# EAGLE design portal parkir atas (EAGLE 9.6.2)
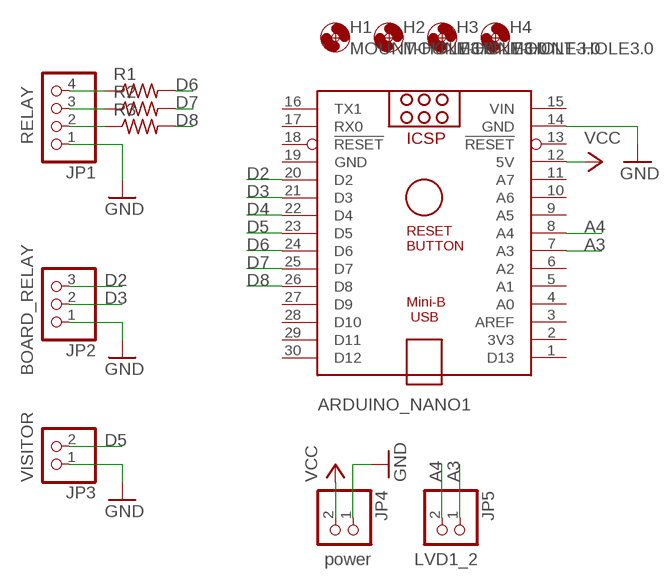
[diagram p0: schematic, sheet 1]

## Parts
ARDUINO_NANO1  ARDUINO_NANO  [ARDUINO_NANO]
H1  MOUNT-HOLE3.0  [3,0]
H2  MOUNT-HOLE3.0  [3,0]
H3  MOUNT-HOLE3.0  [3,0]
H4  MOUNT-HOLE3.0  [3,0]
JP1  PINHD-1X4  [1X04]
JP2  PINHD-1X3  [1X03]
JP3  PINHD-1X2  [1X02]
JP4  PINHD-1X2  [1X02]
JP5  PINHD-1X2  [1X02]
R1  R-US_0309/12  [0309/12]
R2  R-US_0309/12  [0309/12]
R3  R-US_0309/12  [0309/12]

## Nets
A3: ARDUINO_NANO1.7(A3) JP5.1
A4: ARDUINO_NANO1.8(A4) JP5.2
D2: ARDUINO_NANO1.20(D2) JP2.3
D3: ARDUINO_NANO1.21(D3) JP2.2
D4: ARDUINO_NANO1.22(D4)
D5: ARDUINO_NANO1.23(D5) JP3.2
D6: ARDUINO_NANO1.24(D6) R1.2
D7: ARDUINO_NANO1.25(D7) R2.2
D8: ARDUINO_NANO1.26(D8) R3.2
GND: ARDUINO_NANO1.14(GND) JP1.1 JP2.1 JP3.1 JP4.1
N$1: JP1.2 R3.1
N$2: JP1.3 R2.1
N$3: JP1.4 R1.1
VCC: ARDUINO_NANO1.12(5V) JP4.2
Unconnected: ARDUINO_NANO1.1(D13) ARDUINO_NANO1.2(3V3) ARDUINO_NANO1.3(AREF) ARDUINO_NANO1.4(A0) ARDUINO_NANO1.5(A1) ARDUINO_NANO1.6(A2) ARDUINO_NANO1.9(A5) ARDUINO_NANO1.10(A6) ARDUINO_NANO1.11(A7) ARDUINO_NANO1.13(!RESET) ARDUINO_NANO1.16(TX1) ARDUINO_NANO1.17(RX0) ARDUINO_NANO1.18(!RESET) ARDUINO_NANO1.27(D9) ARDUINO_NANO1.28(D10) ARDUINO_NANO1.29(D11) ARDUINO_NANO1.30(D12)

## Notes on the sheet
- RELAY
- BOARD_RELAY
- VISITOR
- power | LVD1_2

## Power pins joined to a net without a drawn wire
GND: ARDUINO_NANO1.19(GND)
VIN: ARDUINO_NANO1.15(VIN)

## Library data of the parts
ARDUINO_NANO1 = ArduinoNanoV30:ARDUINO_NANO: Arduino Nano V3.0 Overview: The Arduino Nano is a small, complete, and breadboard-friendly board based on the ATmega328 (Arduino Nano 3.x) or ATmega168 (Arduino Nano 2.x). It has more or less the same functionality of the Arduino Duemilanove, but in a different package. It lacks only a DC power jack, and works with a Mini-B USB cable instead of a standard one. The Nano was designed and is being produced by Gravitech. Specifications: Microcontroller Atmel ATmega168 or ATmega328 Operating Voltage (logic level) 5 V Input Voltage (recommended) 7-12 V Input Voltage (limits) 6-20 V Digital I/O Pins 14 (of which 6 provide PWM output) Analog Input Pins 8 DC Current per I/O Pin 40 mA Flash Memory 16 KB (ATmega168) or 32 KB (ATmega328) of which 2 KB used by bootloader SRAM 1 KB (ATmega168) or 2 KB (ATmega328) EEPROM 512 bytes (ATmega168) or 1 KB (ATmega328) Clock Speed 16 MHz Dimensions 0.73" x 1.70" Length 45 mm Width 18 mm Weigth 5 g Power: The Arduino Nano can be powered via the Mini-B USB connection, 6-20V unregulated external power supply (pin 30), or 5V regulated external power supply (pin 27). The power source is automatically selected to the highest voltage source. Memory: The ATmega168 has 16 KB of flash memory for storing code (of which 2 KB is used for the bootloader); the ATmega328 has 32 KB, (also with 2 KB used for the bootloader). The ATmega168 has 1 KB of SRAM and 512 bytes of EEPROM (which can be read and written with the EEPROM library); the ATmega328 has 2 KB of SRAM and 1 KB of EEPROM. Input and Output: Each of the 14 digital pins on the Nano can be used as an input or output, using pinMode(), digitalWrite(), and digitalRead() functions. They operate at 5 volts. Each pin can provide or receive a maximum of 40 mA and has an internal pull-up resistor (disconnected by default) of 20-50 kOhms. In addition, some pins have specialized functions. Visit Arduino - ArduinoBoardNano <https://www.arduino.cc/en/Main/ArduinoBoardNano>
H1-H4 = holes:MOUNT-HOLE: MOUNTING HOLE with drill center marker
JP1 = pinhead:PINHD-1X4: PIN HEADER
JP2 = pinhead:PINHD-1X3: PIN HEADER
JP3-JP5 = pinhead:PINHD-1X2: PIN HEADER
R1-R3 = rcl:R-US_: RESISTOR, American symbol; SPICEPREFIX: R

## Board
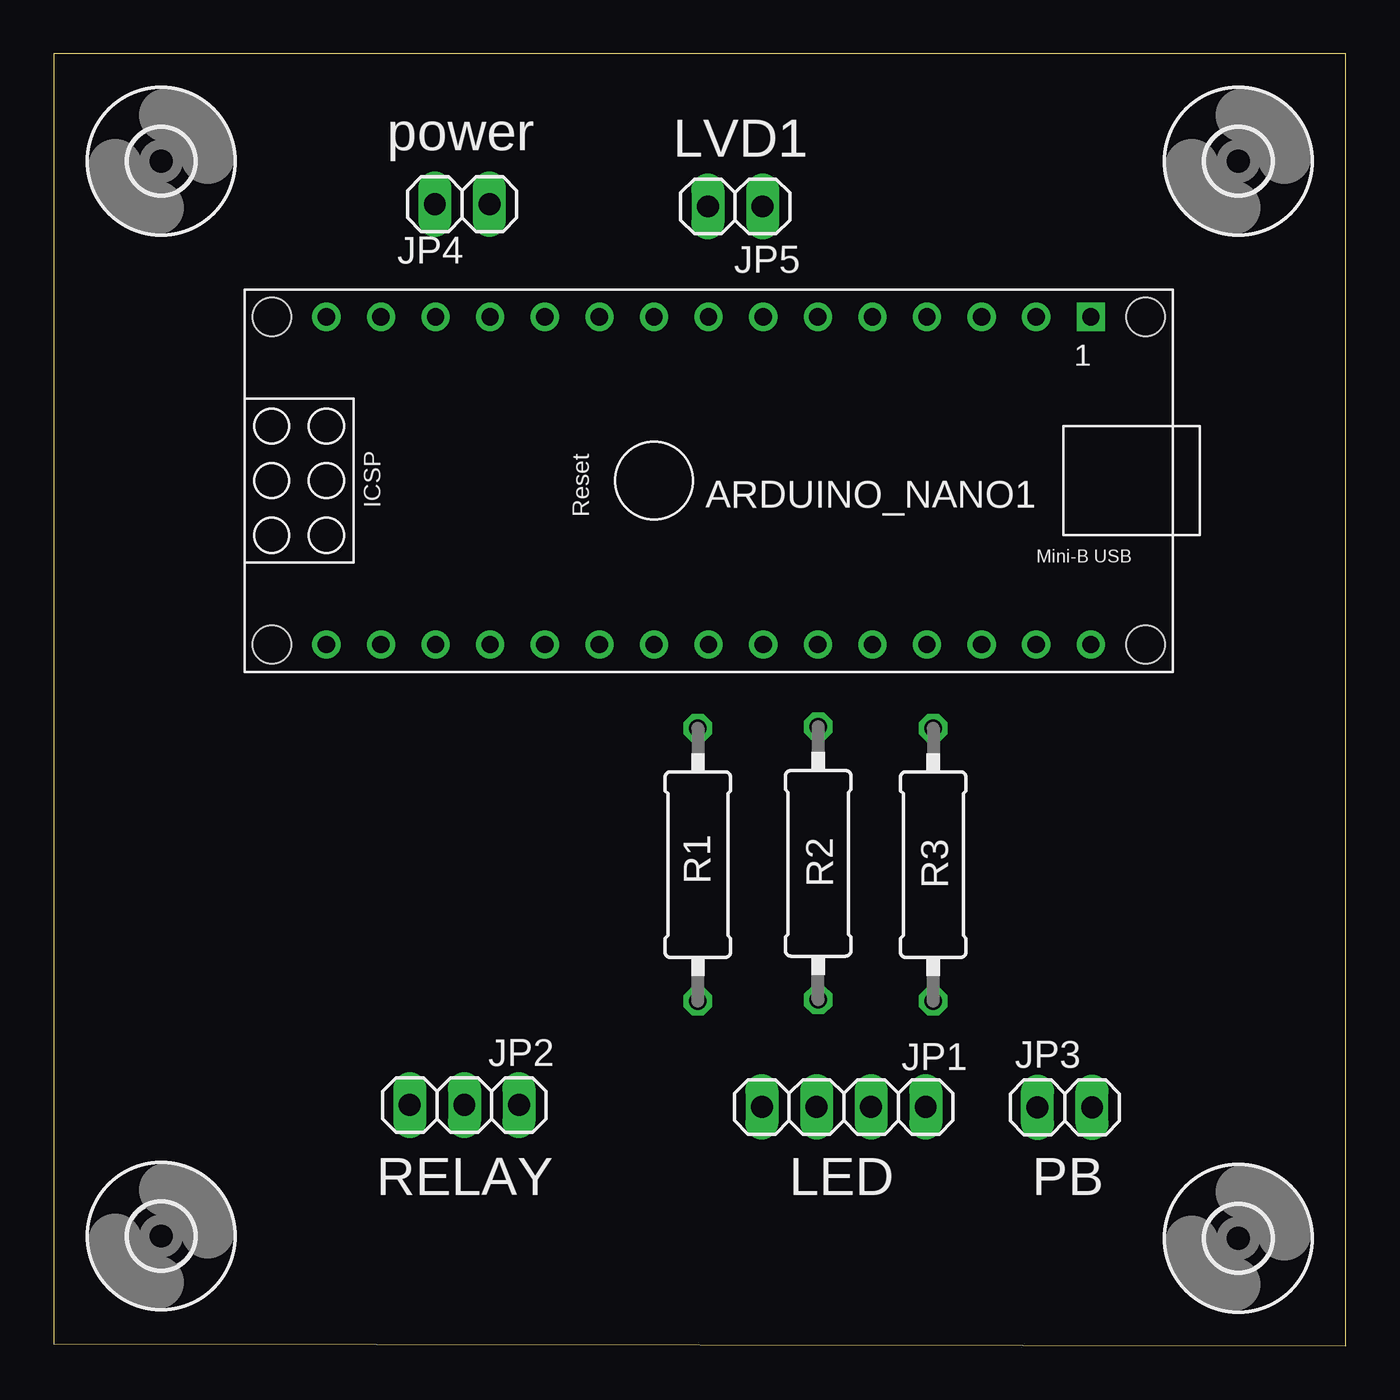
[diagram p1: board, top side]
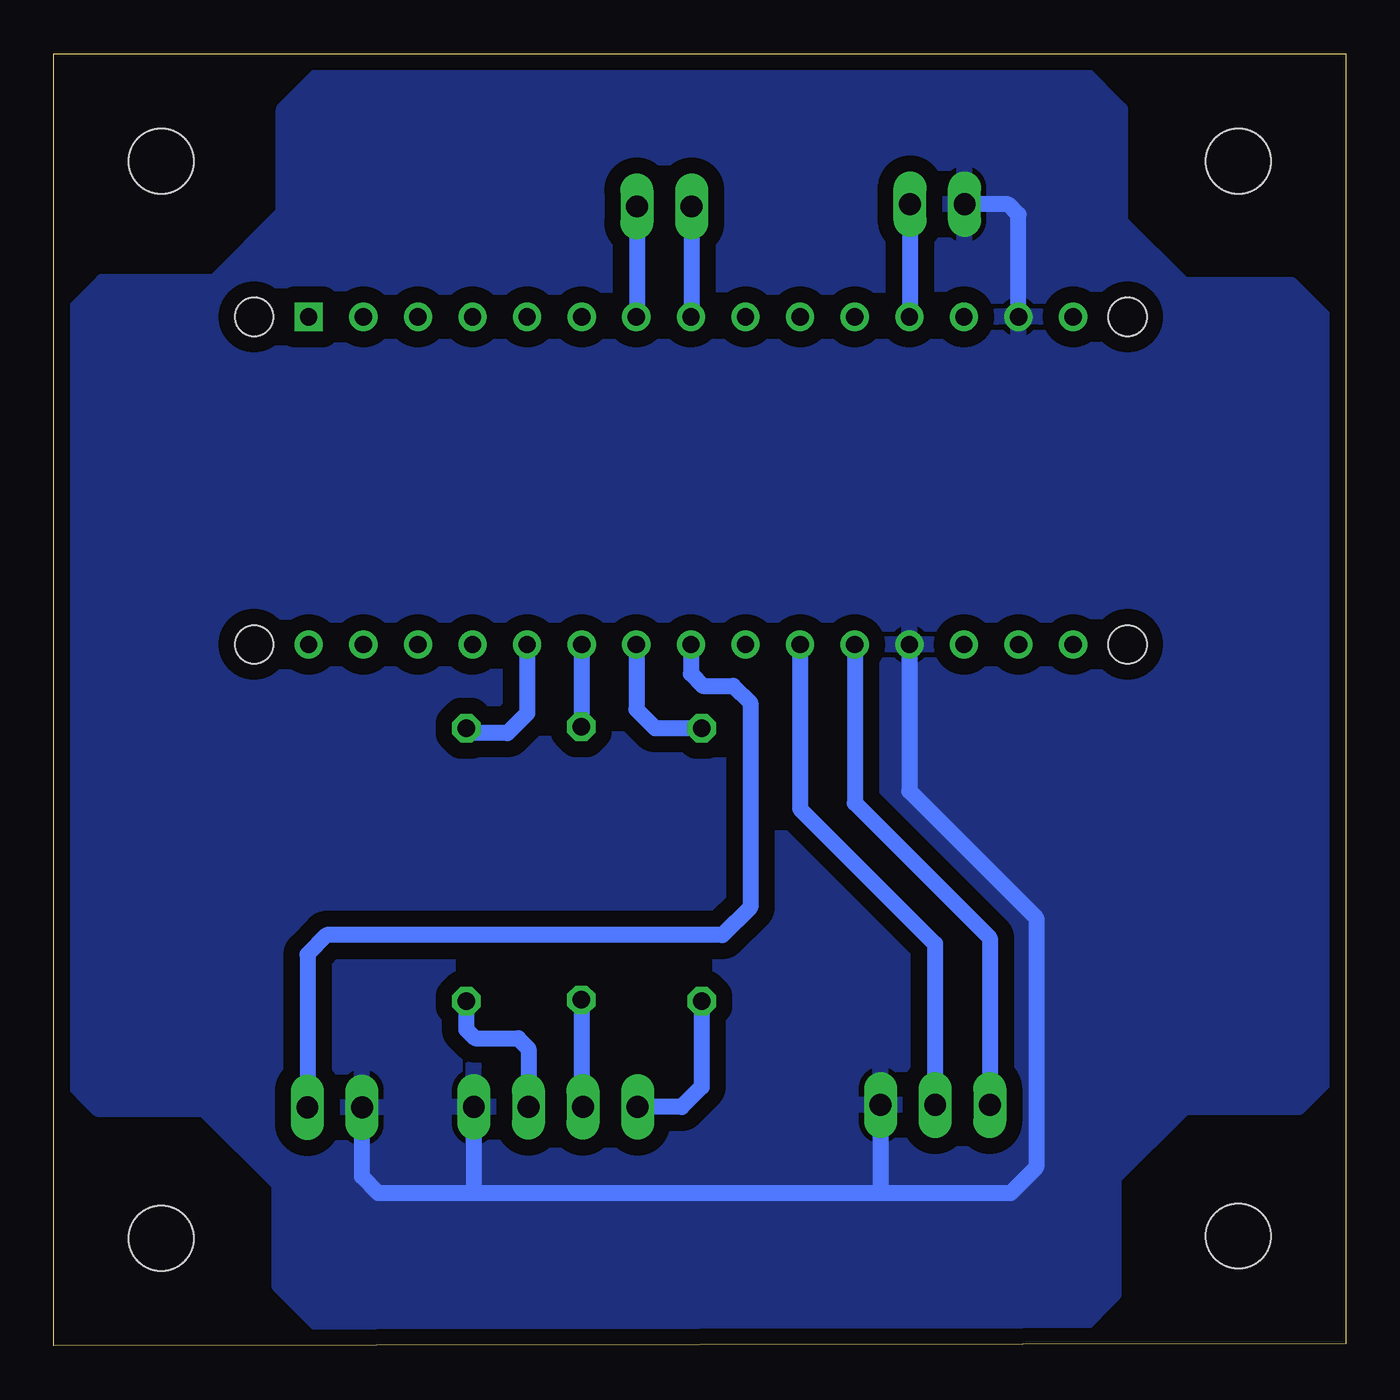
[diagram p2: board, bottom side, seen from below]

Size 60.1 x 60.1 mm. Coordinates in mm from the lower left corner, seen from the top.
Outline: 0,0.1 60.1,0 60.1,60.1 0,60.1 0,0.1
Copper layers (1*16): Top 0.035mm / dielectric 1.5mm / Bottom 0.035mm
Design rules "default": minimum track width 6mil, minimum drill 0.35mm, track to track 12mil, track to pad 12mil, pad to pad 12mil, via to via 6mil, smd to smd 12mil, copper to edge 24mil, drill to drill 6mil, minimum pad ring 10mil, minimum via ring 8mil, stop-mask expansion 4mil, vias tented up to drill 0mil, thermal gap 10mil

### Footprints (pad centres in the part's own frame; a part is rotated, then mirrored left to right if it is on the bottom)
ARDUINO_NANO = drill 0.8 square: 1 -20.32,-7.62 | drill 0.8: 2 -17.78,-7.62; 3 -15.24,-7.62; 4 -12.7,-7.62; 5 -10.16,-7.62; 6 -7.62,-7.62; 7 -5.08,-7.62; 8 -2.54,-7.62; 9 0,-7.62; 10 2.54,-7.62; 11 5.08,-7.62; 12 7.62,-7.62; 13 10.16,-7.62; 14 12.7,-7.62; 15 15.24,-7.62; 16 15.24,7.62; 17 12.7,7.62; 18 10.16,7.62; 19 7.62,7.62; 20 5.08,7.62; 21 2.54,7.62; 22 0,7.62; 23 -2.54,7.62; 24 -5.08,7.62; 25 -7.62,7.62; 26 -10.16,7.62; 27 -12.7,7.62; 28 -15.24,7.62; 29 -17.78,7.62; 30 -20.32,7.62 | hole 1.778: -22.86,-7.62; -22.86,7.62; 17.78,7.62; 17.78,-7.62
3,0 = hole 3: 0,0
1X04 = drill 1.016 long: 1 -3.81,0; 2 -1.27,0; 3 1.27,0; 4 3.81,0
1X03 = drill 1.016 long: 1 -2.54,0; 2 0,0; 3 2.54,0
1X02 = drill 1.016 long: 1 -1.27,0; 2 1.27,0
0309/12 = drill 0.813 octagon: 1 -6.35,0; 2 6.35,0

### Placement (x,y rotation side)
ARDUINO_NANO1  27.92,40.24 180 top
H1  5,55.1 0 top
H2  55.1,55.1 0 top
H3  5,5.1 0 top
H4  55.1,5 0 top
JP1  36.75,11.11 180 top
JP2  19.1,11.2 180 top
JP3  47.03,11.09 0 top
JP4  19,53.1 0 top
JP5  31.7,53 180 top
R1  29.96,22.38 90 top
R2  35.56,22.44 90 top
R3  40.91,22.38 90 top

### Tracks (layer width: path | path; a pad name or v marks a point on that pad's centre or on a via)
A3
  Bottom 0.75: JP5.1 32.97,47.89 ARDUINO_NANO1.7
A4
  Bottom 0.75: JP5.2 30.43,47.89 ARDUINO_NANO1.8
D2
  Bottom 0.75: ARDUINO_NANO1.20 22.84,25.24 16.56,18.96 JP2.3
D3
  Bottom 0.75: ARDUINO_NANO1.21 25.38,24.98 19.1,18.7 JP2.2
D5
  Bottom 0.75: ARDUINO_NANO1.23 30.46,31.26 29.9,30.7 28.5,30.7 27.7,29.9 27.7,20.4 29,19.1 47.4,19.1 48.3,18.2 JP3.2
D6
  Bottom 0.75: ARDUINO_NANO1.24 33,29.6 32.13,28.73 R1.2
D7
  Bottom 0.75: ARDUINO_NANO1.25 35.54,28.81 R2.2
D8
  Bottom 0.75: ARDUINO_NANO1.26 38.08,29.42 39,28.5 40.68,28.5 R3.2
GND
  Bottom 0.75: JP3.1 45.76,7.86 45,7.1 40.5,7.1 | 24.1,7.1 40.5,7.1 | JP1.1 40.56,7.16 40.5,7.1 | ARDUINO_NANO1.19 20.3,25.8 14.4,19.9 14.4,8.3 15.6,7.1 21.5,7.1 | 21.5,7.1 24.19,7.1 | JP2.1 21.64,7.24 21.5,7.1 | ARDUINO_NANO1.14 15.22,52.62 15.7,53.1 JP4.1
  pour Bottom (isolate 0.75): 0.5,12.8 2.2,11.1 7.5,11.1 10.8,7.8 10.8,2.4 12.4,0.8 47.6,0.8 49.6,2.8 49.6,7.5 53.1,11 58,11 59.6,12.6 59.6,47.7 57.8,49.5 52.6,49.5 49.4,52.7 49.4,57.5 47.6,59.3 12.3,59.3 10.5,57.5 10.5,52.3 7.55,49.35 2.55,49.35 0.6,47.4
N$1
  Bottom 0.75: R3.1 40.91,14.71 40.5,14.3 38.5,14.3 38.02,13.82 JP1.2
N$2
  Bottom 0.75: R2.1 35.56,11.19 JP1.3
N$3
  Bottom 0.75: R1.1 29.96,12.04 30.89,11.11 JP1.4
VCC
  Bottom 0.75: JP4.2 20.27,47.89 ARDUINO_NANO1.12

### Text on the board
tNames: power | LVD1 | RELAY | LED | PB